# Altium schematic sheet Aquautomaticv1.0.2.SchDoc
size A3
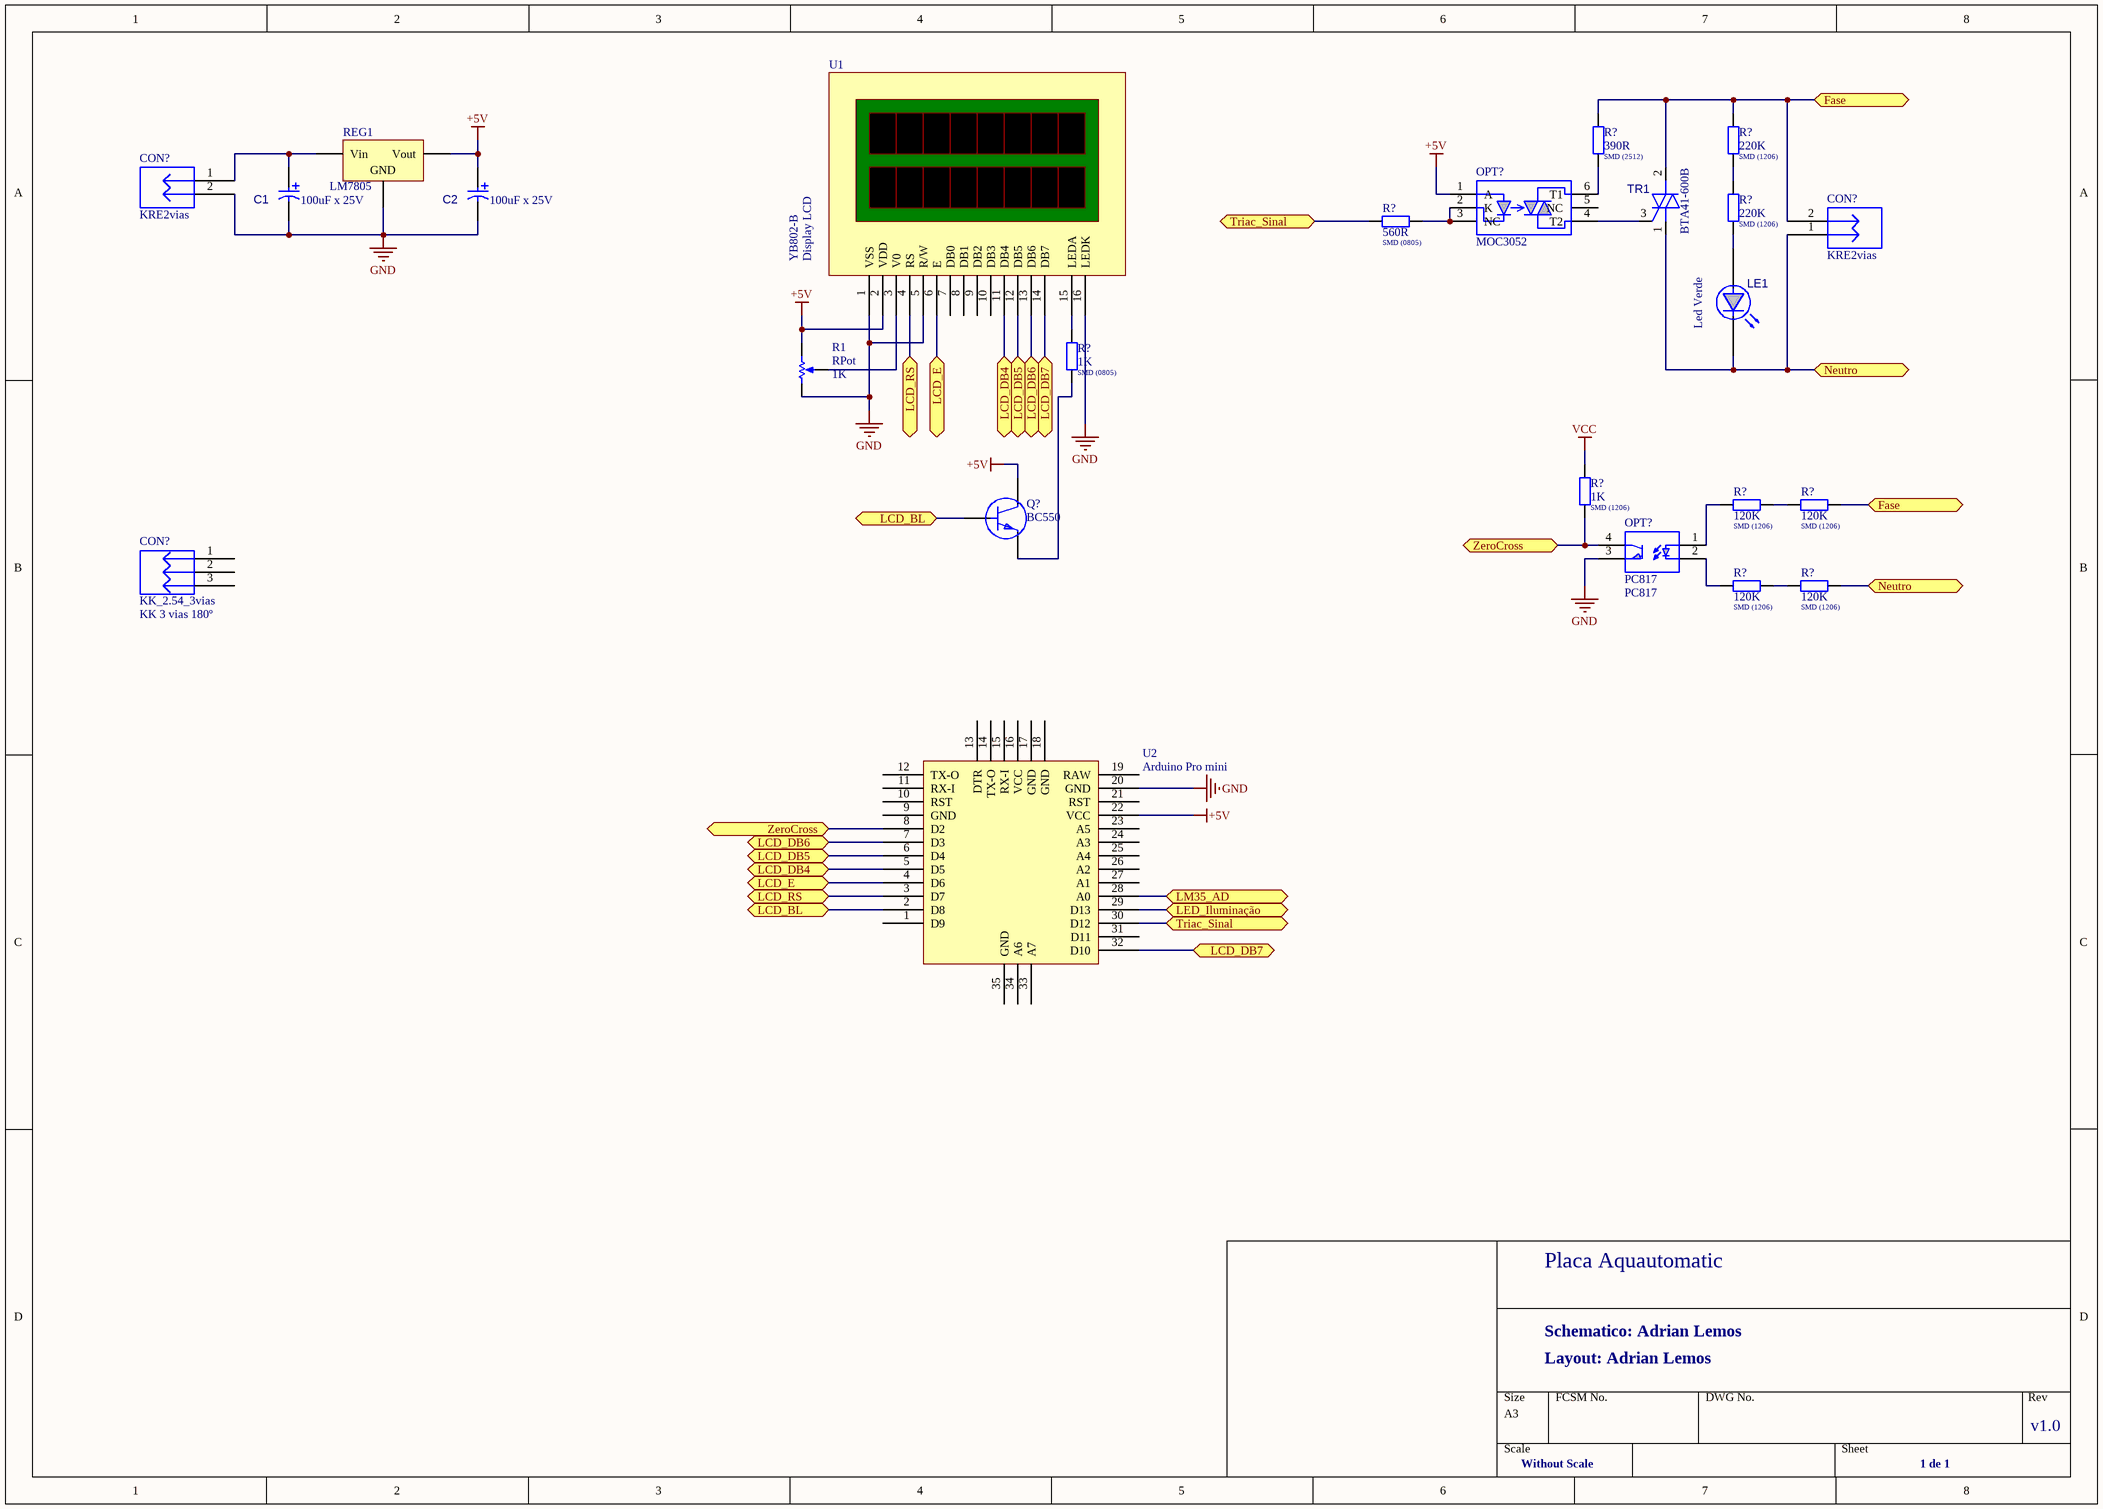
[diagram p0: Aquautomaticv1.0.2.SchDoc]

## Parts
(Parts that share a designator on the sheet are numbered #1, #2 ... from top to bottom, then left to right.)
C1  Valor: 100uF x 25V  [CAPACITOR ELETROLITICO 8x11x3.5mm]  (hidden comment: Capacitor Eletrolitico)
C2  Valor: 100uF x 25V  [CAPACITOR ELETROLITICO 8x11x3.5mm]  (hidden comment: Capacitor Eletrolitico)
CON?#1  KRE2vias  [KRE2-2vias]
CON?#2  KRE2vias  [KRE2-2vias]
CON?#3  KK_2.54_3vias  Valor: KK 3 vias 180º  [KK_3vias_180º]
LE1  Observação: Led Verde  [LED PTH 3mm AZUL]  (hidden comment: LED PTH)
OPT?#1  MOC3052  [DIP-6 SMD]
OPT?#2  PC817  [DIP-4 SMD]
Q?  BC550  [TO92]
R1  RPot  value 1K  [VR5]
R?#1  Valor: 390R  Encapsulamento: SMD (2512)  [RES_2512]  (hidden comment: Resistor SMD)
R?#2  Valor: 220K  Encapsulamento: SMD (1206)  [RES_1206]  (hidden comment: Resistor SMD)
R?#3  Valor: 220K  Encapsulamento: SMD (1206)  [RES_1206]  (hidden comment: Resistor SMD)
R?#4  Valor: 560R  Encapsulamento: SMD (0805)  [RES_0805]  (hidden comment: Resistor SMD)
R?#5  Valor: 1K  Encapsulamento: SMD (0805)  [RES_1206]  (hidden comment: Resistor SMD)
R?#6  Valor: 1K  Encapsulamento: SMD (1206)  [RES_1206]  (hidden comment: Resistor SMD)
R?#7  Valor: 120K  Encapsulamento: SMD (1206)  [RES_1206]  (hidden comment: Resistor SMD)
R?#8  Valor: 120K  Encapsulamento: SMD (1206)  [RES_1206]  (hidden comment: Resistor SMD)
R?#9  Valor: 120K  Encapsulamento: SMD (1206)  [RES_1206]  (hidden comment: Resistor SMD)
R?#10  Valor: 120K  Encapsulamento: SMD (1206)  [RES_1206]  (hidden comment: Resistor SMD)
REG1  LM7805  [TO-220]
TR1  Modelo: BTA41-600B  [BTA41]  (hidden comment: TRIAC BTA41-600B)
U1  Display LCD  Modelo: YB802-B  [DISPLAY LCD YB802-B]
U2  Arduino Pro mini  [Arduino Pro Mini]

## Ports
Fase, LCD_BL, LCD_DB4, LCD_DB5, LCD_DB6, LCD_DB7, LCD_E, LCD_RS, LED_Iluminação, LM35_AD, Neutro, Triac_Sinal, ZeroCross

## Nets
+5V: C2.1(PLUS) OPT?#1.1(A) Q?.1(C) R1.2(BOT) REG1.3(Vout) U1.2(VDD) U2.22(VCC)
GND: C1.2(MINUS) C2.2(MINUS) CON?#1.2 OPT?#2.3(EMISSOR) R1.1(TOP) REG1.2(GND) U1.1(VSS) U1.5(R/W) U1.16(LEDK) U2.20(GND)
VCC: R?#6.2
Fase: CON?#2.2 R?#1.2 R?#2.2 R?#8.2 TR1.2(M2) ; port Fase
LCD_BL: Q?.2(B) U2.2(D8) ; port LCD_BL
LCD_DB4: U1.11(DB4) U2.5(D5) ; port LCD_DB4
LCD_DB5: U1.12(DB5) U2.6(D4) ; port LCD_DB5
LCD_DB6: U1.13(DB6) U2.7(D3) ; port LCD_DB6
LCD_DB7: U1.14(DB7) U2.32(D10) ; port LCD_DB7
LCD_E: U1.6(E) U2.4(D6) ; port LCD_E
LCD_RS: U1.4(RS) U2.3(D7) ; port LCD_RS
LED_Iluminação: U2.29(D13) ; port LED_Iluminação
LM35_AD: U2.28(A0) ; port LM35_AD
Neutro: CON?#2.1 LE1.2 R?#10.2 TR1.1(M1) ; port Neutro
Triac_Sinal: R?#4.1 U2.30(D12) ; port Triac_Sinal
ZeroCross: OPT?#2.4(COLETOR) R?#6.1 U2.8(D2) ; port ZeroCross
NetC1_1: C1.1(PLUS) CON?#1.1 REG1.1(Vin)
NetLE1_1: LE1.1 R?#3.1
NetOPT?#1_2: OPT?#1.2(K) OPT?#1.3(NC) R?#4.2
NetOPT?#1_4: OPT?#1.4(T2) TR1.3(G)
NetOPT?#1_6: OPT?#1.6(T1) R?#1.1
NetOPT?#2_1: OPT?#2.1(A) R?#7.1
NetOPT?#2_2: OPT?#2.2(K) R?#9.1
NetQ?_3: Q?.3(E) R?#5.2
NetR1_3: R1.3(TAP) U1.3(V0)
NetR?#2_1: R?#2.1 R?#3.2
NetR?#5_1: R?#5.1 U1.15(LEDA)
NetR?#7_2: R?#7.2 R?#8.1
NetR?#9_2: R?#9.2 R?#10.1

Not connected (* = marked no-connect by the designer): CON?#3 1 2 3; OPT?#1 5(NC); U1 7(DB0) 8(DB1) 9(DB2) 10(DB3); U2 1(D9) 9(GND) 10(RST) 11(RX-I) 12(TX-O) 13(DTR) 14(TX-O) 15(RX-I) 16(VCC) 17(GND) 18(GND) 19(RAW) 21(RST) 23(A5) 24(A3) 25(A4) 26(A2) 27(A1) 31(D11) 33(A7) 34(A6) 35(GND)

## Notes on the sheet
- Placa Aquautomatic
- Schematico: Adrian Lemos
- Layout: Adrian Lemos
- Without Scale
- 1 de 1
- v1.0

## Library data of the parts
C1 C2 = Capacitor Eletrolitico: Descrição: Capacitor Eletrolitico PTH; Encapsulamento: PTH Radia Xmm x Ymm; Marca: *; Modelo: *; Observação: *
CON?#1 CON?#2 = KRE2vias: Conector 2 vias; Descrição: Conector KRE 2 vias 180º; Encapsulamento: PTH - 180º; Modelo: 2 vias - 180º; Marca: *; Observação: *
CON?#3 = KK_2.54_3vias: Conector KK 2.54mm 3 vias; Descrição: Conector KK 3 vias com passo 2.54mm; Encapsulamento: PTH - 180º; Modelo: 3 vias - 180º; Marca: *; Observação: *
LE1 = LED PTH: Encapsulamento: PTH 3mm; Descrição: Led PTH; Valor: *; Marca: *; Modelo: *
OPT?#1 = MOC3052: OptoAcoplador MOC3052; Descrição: OptoAcoplador Driver Triac; Encapsulamento: PTH-TO-92; Valor: *; Marca: *; Observação: *; Modelo: MOC3052
OPT?#2 = PC817: OptoAcoplador 4 terminais; Encapsulamento: SMD; Descrição: OptoAcoplador 4 Terminais; Valor: *; Marca: *; Observação: *; Modelo: PC817
Q? = BC550: Transistor PTH NPN; Encapsulamento: PTH-TO-92; Descrição: Transistor PTH NPN; Valor: *; Marca: *; Modelo: BC550; Observação: *
R1 = RPot: Potentiometer; Sim Note: Enter the Resistance value and the set point into parameter fields.; Set Position: 0.5; Published: 8-Jun-2000; LatestRevisionDate: 17-Jul-2002; LatestRevisionNote: Re-released for DXP Platform.; PackageReference: VR5; Publisher: Altium Limited; PackageDescription: Variable Resistor, Thru-Hole; 3 Leads
R?#1-R?#10 = Resistor SMD: Descrição: Resistor SMD 5%; Marca: *; Modelo: *; Observação: *
REG1 = LM7805: Regulador de Tensão 5V; Descrição: Regulador de Tensão 3V3; Encapsulamento: PTH TO-220; Valor: *; Marca: *; Observação: *; Modelo: LM7805
TR1 = TRIAC BTA41-600B: TRIAC_TOP3_BTA; Descrição: TRIAC 40 A; Encapsulamento: PTH - BTA41; Valor: *; Marca: *; Observação: *
U1 = LCD Display YB802-B: Descrição: Display LCD 8x2; Encapsulamento: PTH; Valor: *; Marca: *; Observação: *
U2 = Arduino Pro mini: Label: Arduino Pro Mini